# Altium project CP2102.PrjPCB
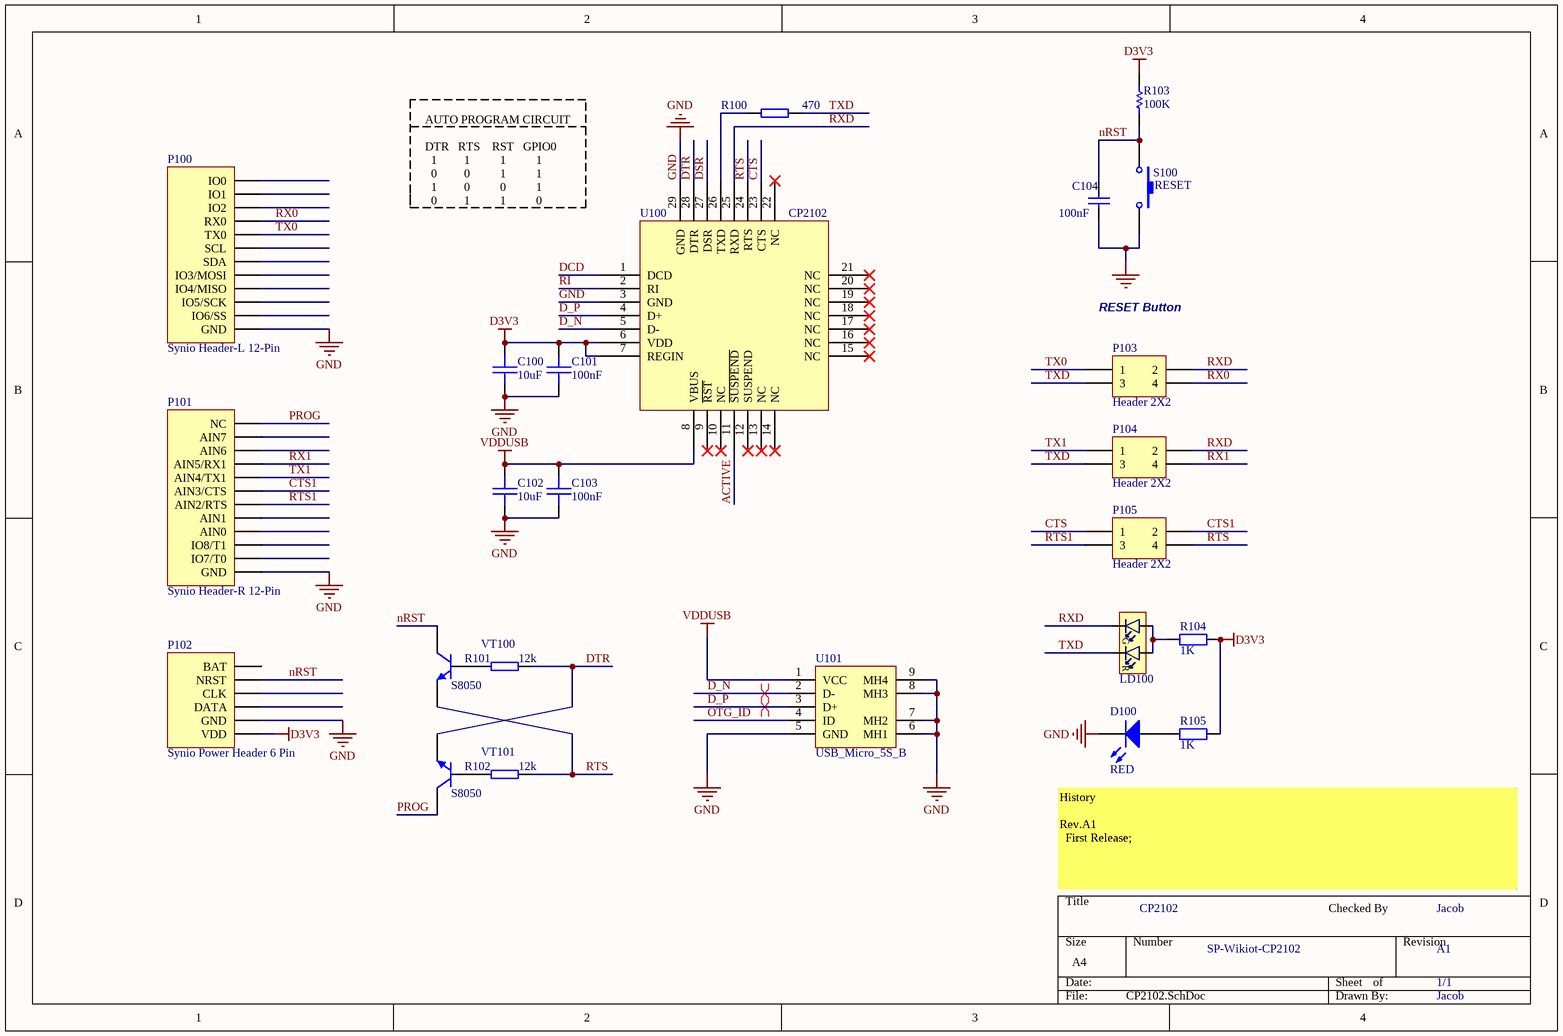
[diagram p0: CP2102.SchDoc]
1 sheet, 24 parts. Net scope: global (net labels, ports and power ports of the same name join across sheets).
Board file: CP2102.PcbDoc

## Sheet CP2102.SchDoc
size A4

### Parts
C100  10uF  [C0603L]
C101  100nF  [C0603L]
C102  10uF  [C0603L]
C103  100nF  [C0603L]
C104  100nF  [0603M]
D100  RED  [SMT_LED_0603]
LD100  LTST-C195KGJRKT  [0805-LED-Bi]  (value not drawn)
P100  Synio Header-L 12-Pin  [HDR1X12/2.54MM]
P101  Synio Header-R 12-Pin  [HDR1X12/2.54MM]
P102  Synio Power Header 6 Pin  [HDR1X6/2.54MM]
P103  Header 2X2  [HDR2X2/2.54MM]
P104  Header 2X2  [HDR2X2/2.54MM]
P105  Header 2X2  [HDR2X2/2.54MM]
R100  470  [R0603]
R101  12k  [R0603]
R102  12k  [R0603]
R103  100K  [0603M]
R104  1K  [0603M]
R105  1K  [0603M]
S100  RESET  [KEY-2x4-SMD]
U100  CP2102  [QFN28]
U101  USB_Micro_5S_B  [USB_MICRO_5S_B]
VT100  S8050  [SMT_TRIODE_NPN]
VT101  S8050  [SMT_TRIODE_NPN]

### Nets
D3V3: C100.1 C101.1 P102.1(VDD) R103.2 R104.1 R105.2 U100.6(VDD) U100.7(REGIN)
GND: C100.2 C101.2 C102.2 C103.2 C104.1 D100.2(K) P100.1(GND) P101.1(GND) P102.2(GND) S100.1 U100.3(GND) U100.29(GND) U101.5(GND) U101.6(MH1) U101.7(MH2) U101.8(MH3) U101.9(MH4)
VDDUSB: C102.1 C103.1 U100.8(VBUS) U101.1(VCC)
ACTIVE: U100.11(~{SUSPEND})
CTS: P105.1 U100.23(CTS)
CTS1: P101.7(AIN3/CTS) P105.2
D_N: U100.5(D-) U101.2(D-)
D_P: U100.4(D+) U101.3(D+)
DCD: U100.1(DCD)
DSR: U100.27(DSR)
DTR: R101.2 U100.28(DTR) VT101.2(E)
nRST: C104.2 P102.5(NRST) R103.1 S100.2 VT100.3(C)
OTG_ID: U101.4(ID)
PROG: P101.12(NC) VT101.3(C)
RI: U100.2(RI)
RTS: P105.4 R102.2 U100.24(RTS) VT100.2(E)
RTS1: P101.6(AIN2/RTS) P105.3
RX0: P100.9(RX0) P103.4
RX1: P101.9(AIN5/RX1) P104.4
RXD: LD100.1(C1) P103.2 P104.2 U100.25(RXD)
TX0: P100.8(TX0) P103.1
TX1: P101.8(AIN4/TX1) P104.1
TXD: LD100.2(C2) P103.3 P104.3 R100.2
NetD100_1: D100.1(A) R105.1
NetLD100_3: LD100.3(A2) LD100.4(A1) R104.2
NetR100_1: R100.1 U100.26(TXD)
NetR101_1: R101.1 VT100.1(B)
NetR102_1: R102.1 VT101.1(B)

Not connected (* = marked no-connect by the designer): P100 2(IO6/SS) 3(IO5/SCK) 4(IO4/MISO) 5(IO3/MOSI) 6(SDA) 7(SCL) 10(IO2) 11(IO1) 12(IO0); P101 2(IO7/T0) 3(IO8/T1) 4(AIN0) 5(AIN1) 10(AIN6) 11(AIN7); P102 3(DATA) 4(CLK) 6(BAT); U100 9(~{RST})* 10(NC)* 12(SUSPEND)* 13(NC)* 14(NC)* 15(NC)* 16(NC)* 17(NC)* 18(NC)* 19(NC)* 20(NC)* 21(NC)* 22(NC)*

### Layout directives
differential pair: D_N, D_P

### Notes on the sheet
- AUTO PROGRAM CIRCUIT
  DTR   RTS    RST   GPIO0
  1         1          1          1
  0         0          1          1
  1         0          0          1
  0         1          1          0
- RESET Button
- History
  Rev.A1
  First Release;
- CP2102
- Checked By
- Jacob
- SP-Wikiot-CP2102
- A1
- 1/1
- (in symbol LED-DUAL) G; R

### Library data of the parts
C100-C103 = SMT_C_0402: Surface mount capacitor 0402
C104 = CAP: Capacitor; Published: 8-Jun-2000; Revision: July-2002: Re-released for DXP Platform.; Publisher: Altium Limited; Value: 100nF
D100 = LED0: Typical INFRARED GaAs LED; Published: 8-Jun-2000; LatestRevisionDate: 08-Jul-2005; LatestRevisionNote: Mech Layer 1 removed.; PackageReference: LED-0; Publisher: Altium Limited
LD100 = LED-DUAL: Avago, HSMF-A203 Bi-Color LED; Manufacturer: Lite-On Inc; 2nd source part number: 859-LTST-C195KGJRKT; Note: HSMF-A203- xxxxx GaP Red GaP Emerald Green; Artikkelnr Noca: 13019145; Part Number: LTST-C195KGJRKT; Manufacturer Part Number: LTST-C195KGJRKT; Datasheet: http://media.digikey.com/pdf/Data%20Sheets/Lite-On%20PDFs/LTST-C195KGJRKT.pdf; Footprint: LED_DUAL_0606; LatestRevisionDate: 2012-07-05; Pin Count: 4; Publisher: Nordic Semiconductor; Published: 2012-07-05; Value: LTST-C195KGJRKT; Supplier: Digi-Key; Supplier part number: 160-1452-1-ND; 2nd source Supplier: Mouser
P100 = Synio Header-L 12-Pin: Synio Header-L, 12-Pin; LatestRevisionDate: 17-Jul-2002; LatestRevisionNote: Re-released for DXP Platform.; Publisher: Altium Limited
P101 = Synio Header-R 12-Pin: Synio Header-R, 12-Pin; LatestRevisionDate: 17-Jul-2002; LatestRevisionNote: Re-released for DXP Platform.; Publisher: Altium Limited
P103-P105 = Header 2X2: Header, 2-Pin, Dual row; LatestRevisionDate: 17-Jul-2002; LatestRevisionNote: Re-released for DXP Platform.; Publisher: Altium Limited
R100-R102 = SMT_R_0402: Surface mount resistor 0402
R103 = res1: Resistor; Fitted: NO; Published: 8-Jun-2000; Revision: July-2002: Re-released for DXP Platform.; Publisher: Altium Limited; Value: 100K
R104 R105 = Res2: Resistor; Published: 8-Jun-2000; LatestRevisionDate: 17-Jul-2002; LatestRevisionNote: Re-released for DXP Platform.; PackageReference: AXIAL-0.4; Publisher: Altium Limited; Value: 1K
S100 = SW-PB: Switch; Published: 24-Mar-1999; LatestRevisionDate: 17-Jul-2002; LatestRevisionNote: Re-released for DXP Platform.; PackageReference: SPST-2; Publisher: Altium Limited
U101 = USB_Micro_5S_B: USB micro female SMT with 4 fixed foot
VT100 VT101 = SMT_TRIODE_NPN: Surface mount NPN transistor, package SOT-23